# EAGLE design Leaf Node 1.0 (EAGLE 8.3.1)
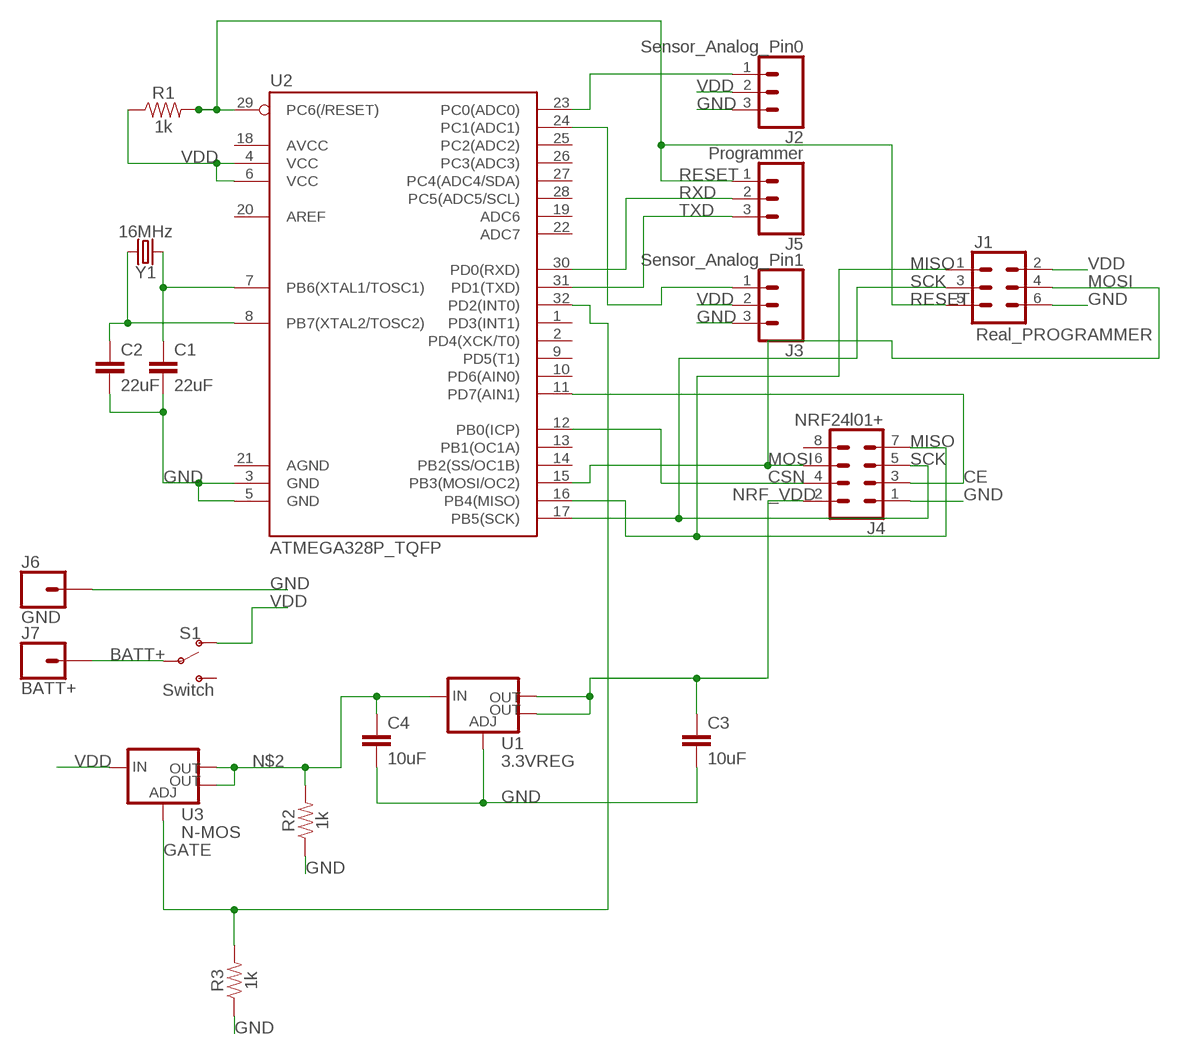
[diagram p0: schematic, sheet 1]

## Parts
C1  22uF  22UF-0805-6.3V-20%  [0805]
C2  22uF  22UF-0805-6.3V-20%  [0805]
C3  10uF  2.2UF-0805-25V-(+80/-20%)  [0805]
C4  10uF  2.2UF-0805-25V-(+80/-20%)  [0805]
J1  Real_PROGRAMMER  CONN_03X2FEMALE  [2X3]
J2  Sensor_Analog_Pin0  CONN_03  [1X03]
J3  Sensor_Analog_Pin1  CONN_03  [1X03]
J4  NRF24l01+  CONN_04X2  [2X4]
J5  Programmer  CONN_03  [1X03]
J6  GND  CONN_01  [1X01]
J7  BATT+  CONN_01  [1X01]
R1  1k  0.22OHM-0805-1/4W-1%  [0805]
R2  1k  0.22OHM-0805-1/4W-1%  [0805]
R3  1k  0.22OHM-0805-1/4W-1%  [0805]
S1  Switch  SWITCH-SPDT-PTH-11.6X4.0MM  [SWITCH_SPDT_PTH_11.6X4.0MM]
U1  3.3VREG  V_REG_LM1117SOT223  [SOT223]
U2  ATMEGA328P_TQFP  [TQFP32-08]
U3  N-MOS  V_REG_LM1117SOT223  [SOT223]
Y1  16MHz  CRYSTAL-16MHZPTH-HC49US  [HC49US]

## Nets
BATT+: J7.1 S1.2(P)
CE: J4.3 U2.11(PD7(AIN1))
CSN: J4.4 U2.12(PB0(ICP))
GATE: R3.2 U2.32(PD2(INT0)) U3.1(ADJ)
GND: C1.2 C2.2 C3.2 C4.2 J1.6 J2.3 J3.3 J4.1 J6.1 R2.1 R3.1 U1.1(ADJ) U2.3(GND) U2.5(GND)
MISO: J1.1 J4.7 U2.16(PB4(MISO))
MOSI: J1.4 J4.6 U2.15(PB3(MOSI/OC2))
N$1: C2.1 U2.8(PB7(XTAL2/TOSC2)) Y1.2
N$2: C4.1 R2.2 U1.3(IN) U3.2(OUT) U3.4(OUT)
N$3: C1.1 U2.7(PB6(XTAL1/TOSC1)) Y1.1
N$9: J3.1 U2.24(PC1(ADC1))
N$11: J2.1 U2.23(PC0(ADC0))
NRF_VDD: C3.1 J4.2 U1.2(OUT) U1.4(OUT)
RESET: J1.5 J5.1 R1.2 U2.29(PC6(/RESET))
RXD: J5.2 U2.30(PD0(RXD))
SCK: J1.3 J4.5 U2.17(PB5(SCK))
TXD: J5.3 U2.31(PD1(TXD))
VDD: J1.2 J2.2 J3.2 R1.1 S1.1(O) U2.4(VCC) U2.6(VCC) U3.3(IN)
Unconnected: J4.8 S1.3(S) U2.1(PD3(INT1)) U2.2(PD4(XCK/T0)) U2.9(PD5(T1)) U2.10(PD6(AIN0)) U2.13(PB1(OC1A)) U2.14(PB2(SS/OC1B)) U2.18(AVCC) U2.19(ADC6) U2.20(AREF) U2.21(AGND) U2.22(ADC7) U2.25(PC2(ADC2)) U2.26(PC3(ADC3)) U2.27(PC4(ADC4/SDA)) U2.28(PC5(ADC5/SCL))

## Library data of the parts
C1 C2 = SparkFun-Capacitors:22UF: 22µF ceramic capacitors A capacitor is a passive two-terminal electrical component used to store electrical energy temporarily in an electric field.; PROD_ID: CAP-08402
C3 C4 = SparkFun-Capacitors:2.2UF: 2.2µF ceramic capacitors A capacitor is a passive two-terminal electrical component used to store electrical energy temporarily in an electric field.; PROD_ID: CAP-11624; VALUE: 2.2uF
J1 = SparkFun-Connectors:CONN_03X2: Multi connection point. Often used as Generic Header-pin footprint for 0.1 inch spaced/style header connections You can populate with any combo of single row headers, but if you'd like an exact match, check these: Header - 2x3 (Male, 0.1") <https://www.sparkfun.com/products/12807> (PRT-12807) Header - 2x3 (Female, 0.1") <https://www.sparkfun.com/products/13010> (PRT-13010) 2x3 Pin Shrouded Header <https://www.sparkfun.com/products/10877> (PRT-10877) On any of the 0.1 inch spaced packages, you can populate with these: Break Away Headers - Straight <https://www.sparkfun.com/products/116> (PRT-00116) Break Away Male Headers - Right Angle <https://www.sparkfun.com/products/553> (PRT-00553) Female Headers <https://www.sparkfun.com/products/115> (PRT-00115) Break Away Headers - Machine Pin <https://www.sparkfun.com/products/117> (PRT-00117) Break Away Female Headers - Swiss Machine Pin <https://www.sparkfun.com/products/743> (PRT-00743) Special note: the shrouded connector mates well with our 3x2 ribbon cables: Ribbon Crimp Connector - 6-pin (2x3, Female) <https://www.sparkfun.com/products/10651> (PRT-10651) Ribbon Cable - 6 wire (15ft) <https://www.sparkfun.com/products/10646> (PRT-10646); PROD_ID: CONN-11566; VALUE: FEMALE 2x3
J2 J3 J5 = SparkFun-Connectors:CONN_03: Multi connection point. Often used as Generic Header-pin footprint for 0.1 inch spaced/style header connections On any of the 0.1 inch spaced packages, you can populate with these: Break Away Headers - Straight <https://www.sparkfun.com/products/116> (PRT-00116) Break Away Male Headers - Right Angle <https://www.sparkfun.com/products/553> (PRT-00553) Female Headers <https://www.sparkfun.com/products/115> (PRT-00115) Break Away Headers - Machine Pin <https://www.sparkfun.com/products/117> (PRT-00117) Break Away Female Headers - Swiss Machine Pin <https://www.sparkfun.com/products/743> (PRT-00743) Stackable Header - 3 Pin (Female, 0.1") <https://www.sparkfun.com/products/13875> (PRT-13875) For SCREWTERMINALS and SPRING TERMINALS visit here: Screw Terimnals on SparkFun.com <https://www.sparkfun.com/search/results?term=Screw+Terminals> (5mm/3.5mm/2.54mm spacing) This device is also useful as a general connection point to wire up your design to another part of your project. Our various solder wires solder well into these plated through hole pads. Hook-Up Wire - Assortment (Stranded, 22 AWG) <https://www.sparkfun.com/products/11375> (PRT-11375) Hook-Up Wire - Assortment (Solid Core, 22 AWG) <https://www.sparkfun.com/products/11367> (PRT-11367) View the entire wire category on our website here <https://www.sparkfun.com/categories/141> Special notes: Molex polarized connector foot print use with SKU : PRT-08232 with associated crimp pins and housings.
J4 = SparkFun-Connectors:CONN_04X2: Multi connection point. Often used as Generic Header-pin footprint for 0.1 inch spaced/style header connections On any of the 0.1 inch spaced packages, you can populate with these: Break Away Headers - Straight <https://www.sparkfun.com/products/116> (PRT-00116) Break Away Male Headers - Right Angle <https://www.sparkfun.com/products/553> (PRT-00553) Female Headers <https://www.sparkfun.com/products/115> (PRT-00115) Break Away Headers - Machine Pin <https://www.sparkfun.com/products/117> (PRT-00117) Break Away Female Headers - Swiss Machine Pin <https://www.sparkfun.com/products/743> (PRT-00743)
J6 J7 = SparkFun-Connectors:CONN_01: Single connection point. Often used as Generic Header-pin footprint for 0.1 inch spaced/style header connections On any of the 0.1 inch spaced packages, you can populate with these: Break Away Headers - Straight <https://www.sparkfun.com/products/116> (PRT-00116) Break Away Male Headers - Right Angle <https://www.sparkfun.com/products/553> (PRT-00553) Female Headers <https://www.sparkfun.com/products/115> (PRT-00115) Break Away Headers - Machine Pin <https://www.sparkfun.com/products/117> (PRT-00117) Break Away Female Headers - Swiss Machine Pin <https://www.sparkfun.com/products/743> (PRT-00743) This device is also useful as a general connection point to wire up your design to another part of your project. Our various solder wires solder well into these plated through hole pads. Hook-Up Wire - Assortment (Stranded, 22 AWG) <https://www.sparkfun.com/products/11375> (PRT-11375) Hook-Up Wire - Assortment (Solid Core, 22 AWG) <https://www.sparkfun.com/products/11367> (PRT-11367) View the entire wire category on our website here <https://www.sparkfun.com/categories/141> Special notes: SMTSO-256-ET is a "flush mount" nut for a 4-40 screw. We mostly use this on specialty testbeds; it is a nice way to connect hardware to your PCB at an adjustable hieght. Also note, the SNAP packages are for using a snappable style connector. We sell a baggie of snaps and they are also used on two LilyPad designs: Snap Assortment - 30 pack (male and female) <https://www.sparkfun.com/products/11347> (DEV-11347) LilyPad Arduino SimpleSnap <https://www.sparkfun.com/products/10941> (DEV-10941) LilyPad SimpleSnap Protoboard <https://www.sparkfun.com/products/10940> (DEV-10940)
R1-R3 = SparkFun-Resistors:0.22OHM: 0.22Ω resistor A resistor is a passive two-terminal electrical component that implements electrical resistance as a circuit element. Resistors act to reduce current flow, and, at the same time, act to lower voltage levels within circuits. - Wikipedia; PROD_ID: RES-09883; VALUE: 0.22
S1 = SparkFun-Switches:SWITCH-SPDT: Single Pole, Double Throw (SPDT) Switch Single-pole, double-throw (SPDT) switch. Variant Overview SMD-AYZ0202 Surface Mount DPDT Switch <https://www.sparkfun.com/products/597> (COM-00597) Used on e.g. LilyPad Arduino USB - ATmega32U4 Board <https://www.sparkfun.com/products/12049> PTH-11.6X4.0MM SPDT Mini Power Switch <https://www.sparkfun.com/products/102> (COM-00102) Used on e.g. SparkFun Simon Says - Through-Hole Soldering Kit <https://www.sparkfun.com/products/10547> (KIT-10547) PTH-11.6X4.0MM-KIT KIT version of SPDT Mini Power Switch - Simplifies soldering by removing tStop of switch pins - only one side can be soldered. PTH-11.6X4.0MM-LOCK LOCK version of SPDT Mini Power Switch - Offset pins hold switch in place for easier soldering. SMD-RIGHT-ANGLE Surface Mount Right Angle Switch <https://www.sparkfun.com/products/10860> (COM-10860) Used on e.g. SparkFun ESP8266 Thing <https://www.sparkfun.com/products/13231>; PROD_ID: SWCH-08261; SF_SKU: COM-00102
U1 U3 = SparkFun-IC-Power:V_REG_LM1117: Voltage Regulator LM1117 Standard adjustable voltage regulator but in SMD form. Spark Fun Electronics SKU : COM-00595; PROD_ID: VREG-08170
U2 = SparkFun-IC-Microcontroller:ATMEGA328P_TQFP: Popular 328P in QFP Storefront component: ATmega328 - TQFP <https://www.sparkfun.com/products/13448> (COM-13448) Datasheet <http://www.sparkfun.com/datasheets/Components/SMD/ATMega328.pdf> SparkFun Products SparkFun RedBoard - Programmed with Arduino <https://www.sparkfun.com/products/12757> (DEV-12757) Arduino Pro Mini 328 - 5V/16MHz <https://www.sparkfun.com/products/11113> (DEV-11113) Arduino Pro Mini 328 - 3.3V/8MHz <https://www.sparkfun.com/products/11114> (DEV-11114) SparkFun OpenLog <https://www.sparkfun.com/products/13712> (DEV-13712) SparkFun MicroView - OLED Arduino Module <https://www.sparkfun.com/products/12923> (DEV-12923) SparkFun Digital Sandbox <https://www.sparkfun.com/products/12651> (DEV-12651) SparkFun PicoBoard <https://www.sparkfun.com/products/11888> (WIG-11888) Arduino Fio <https://www.sparkfun.com/products/10116> (DEV-10116) LilyPad Arduino 328 Main Board <https://www.sparkfun.com/products/13342> (DEV-13342) SparkFun RedStick <https://www.sparkfun.com/products/13741> (DEV-13741) LilyPad MP3 <https://www.sparkfun.com/products/11013> (DEV-11013) LilyPad Arduino SimpleSnap <https://www.sparkfun.com/products/10941> (DEV-10941) SparkFun Stepoko <https://www.sparkfun.com/products/13899> (ROB-13899) SparkFun Geiger Counter <https://www.sparkfun.com/products/11345> (SEN-11345) SparkFun EL Sequencer <https://www.sparkfun.com/products/12781> (COM-12781) Arduino Pro 328 - 5V/16MHz <https://www.sparkfun.com/products/10915> (DEV-10915) CryptoCape <https://www.sparkfun.com/products/12773> (DEV-12773) SparkFun IR Thermometer Evaluation Board - MLX90614 <https://www.sparkfun.com/products/10740> (SEN-10740) SparkFun RedBot Mainboard <https://www.sparkfun.com/products/12097> (ROB-12097) Arduino Pro 328 - 3.3V/8MHz <https://www.sparkfun.com/products/10914> (DEV-10914) SparkFun Block for Intel® Edison - Arduino <https://www.sparkfun.com/products/13036> (DEV-13036) SparkFun Simon Says - Surface Mount Soldering Kit <https://www.sparkfun.com/products/10935> (KIT-10935) SparkFun 7-Segment Serial Display - Red <https://www.sparkfun.com/products/11441> (COM-11441) SparkFun 7-Segment Serial Display - White <https://www.sparkfun.com/products/11629> (COM-11629) SparkFun 7-Segment Serial Display - Yellow <https://www.sparkfun.com/products/11443> (COM-11443) SparkFun 7-Segment Serial Display - Kelly Green <https://www.sparkfun.com/products/11440> (COM-11440) SparkFun 7-Segment Serial Display - Blue <https://www.sparkfun.com/products/11442> (COM-11442) SparkFun OpenSegment Serial Display - 20mm (Blue) <https://www.sparkfun.com/products/11647> (COM-11647) SparkFun OpenSegment Serial Display - 20mm (Green) <https://www.sparkfun.com/products/11646> (COM-11646) SparkFun OpenSegment Serial Display - 20mm (White) <https://www.sparkfun.com/products/11648> (COM-11648) SparkFun OpenSegment Serial Display - 20mm (Red) <https://www.sparkfun.com/products/11644> (COM-11644) SparkFun OpenSegment Serial Display - 20mm (Yellow) <https://www.sparkfun.com/products/11645> (COM-11645) SparkFun OpenSegment Shield <https://www.sparkfun.com/products/13190> (DEV-13190); PROD_ID: IC-09069
Y1 = SparkFun-Clocks:CRYSTAL-16MHZ: 16MHz Crystal Digikey Example <http://www.digikey.com/product-search/en?keywords=535-9122-1-ND> Frequency: 16MHz Frequency Stability: ±50ppm Frequency Tolerance: ±20ppm Load Capacitance: 18pF SparkFun Products: Pro Micro -5V/16MHz <https://www.sparkfun.com/products/12640> SparkFun Serial Enabled LCD Kit <https://www.sparkfun.com/products/10097>; PROD_ID: XTAL-08181; SF_ID: COM-00536

## Board
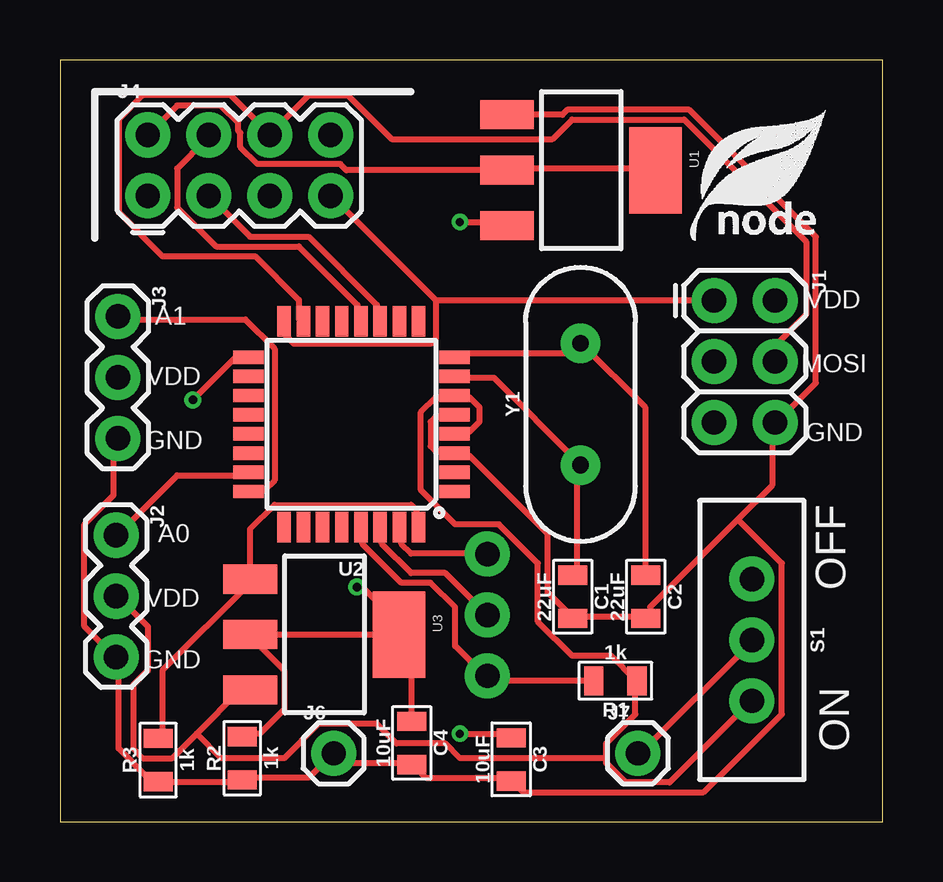
[diagram p1: board, top side]
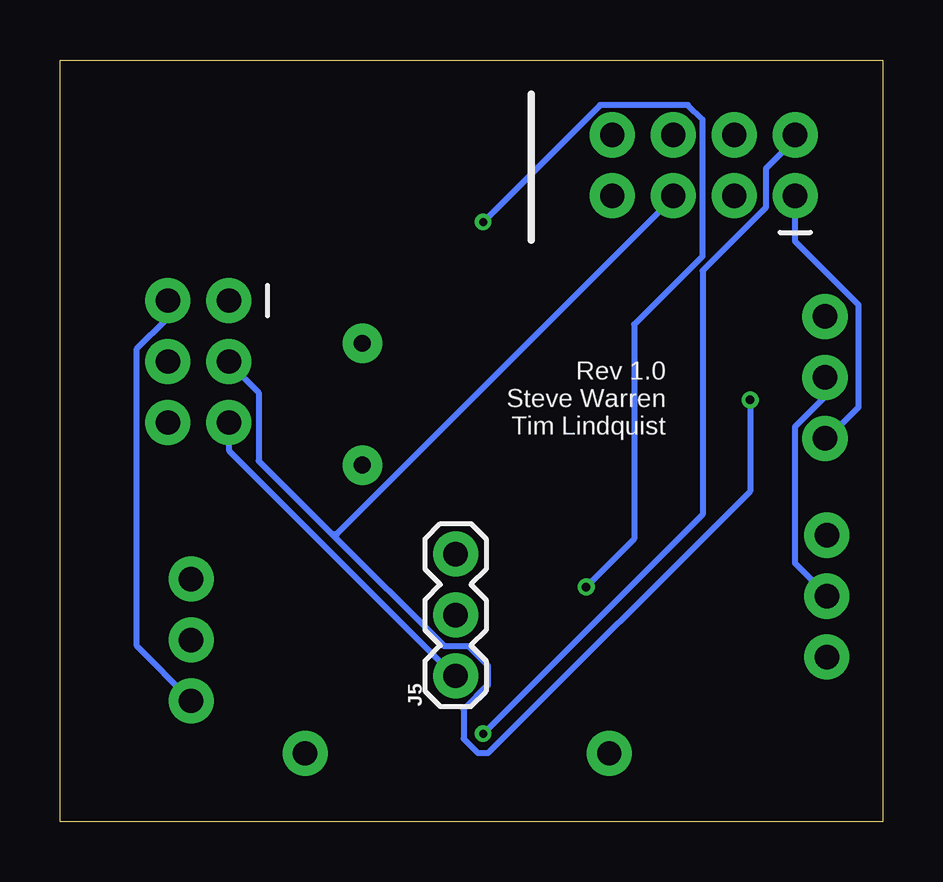
[diagram p2: board, bottom side, seen from below]

Size 34.29 x 31.75 mm. Coordinates in mm from the lower left corner, seen from the top.
Outline: 0,0 34.29,0 34.29,31.75 0,31.75 0,0
Copper layers (1*16): Top 0.0356mm / dielectric 1.5011mm / Bottom 0.0356mm
Design rules "LaenPCBOrder *": minimum track width 10mil, minimum drill 13mil, track to track 6mil, track to pad 6mil, pad to pad 6mil, via to via 6mil, smd to smd 6mil, copper to edge 15mil, drill to drill 6mil, minimum pad ring 7mil, minimum via ring 7mil, stop-mask expansion 3mil, vias tented up to drill 0mil, thermal gap 10mil

### Footprints (pad centres in the part's own frame; a part is rotated, then mirrored left to right if it is on the bottom)
0805 = smd 0.8 x 1.2: 1 -0.9,0; 2 0.9,0
2X3 = drill 1.016 pad 1.88: 1 0,0; 2 0,2.54; 3 2.54,0; 4 2.54,2.54; 5 5.08,0; 6 5.08,2.54
1X03 = drill 1.016 pad 1.88: 1 0,0; 2 2.54,0; 3 5.08,0
2X4 = drill 1.016 pad 1.88: 1 -3.81,-1.27; 2 -3.81,1.27; 3 -1.27,-1.27; 4 -1.27,1.27; 5 1.27,-1.27; 6 1.27,1.27; 7 3.81,-1.27; 8 3.81,1.27
1X01 = drill 1.016 pad 1.88: 1 0,0
SWITCH_SPDT_PTH_11.6X4.0MM = drill 1.016 pad 1.88: 1 0,2.54; 2 0,0; 3 0,-2.54
SOT223 = smd 1.219 x 2.235: 1 -2.311,-3.099; 2 0,-3.099; 3 2.311,-3.099 | smd 3.6 x 2.2: 4 0,3.099
TQFP32-08 = smd 1.27 x 0.559: 1 -4.293,2.8; 2 -4.293,2; 3 -4.293,1.2; 4 -4.293,0.4; 5 -4.293,-0.4; 6 -4.293,-1.2; 7 -4.293,-2; 8 -4.293,-2.8; 17 4.293,-2.8; 18 4.293,-2; 19 4.293,-1.2; 20 4.293,-0.4; 21 4.293,0.4; 22 4.293,1.2; 23 4.293,2; 24 4.293,2.8 | smd 0.559 x 1.27: 9 -2.8,-4.293; 10 -2,-4.293; 11 -1.2,-4.293; 12 -0.4,-4.293; 13 0.4,-4.293; 14 1.2,-4.293; 15 2,-4.293; 16 2.8,-4.293; 25 2.8,4.293; 26 2,4.293; 27 1.2,4.293; 28 0.4,4.293; 29 -0.4,4.293; 30 -1.2,4.293; 31 -2,4.293; 32 -2.8,4.293
HC49US = drill 0.7 pad 1.651: 1 -2.54,0; 2 2.54,0

### Placement (x,y rotation side)
C1  21.36,9.37 270 top
C2  24.41,9.37 270 top
C3  18.8,2.59 270 top
C4  14.66,3.28 270 top
J1  27.25,21.72 270 top
J2  2.34,11.94 270 top
J3  2.41,21.06 270 top
J4  7.47,27.36 0 top
J5  17.81,6.07 90 bottom
J6  11.4,2.84 0 top
J7  24.08,2.84 0 top
R1  23.14,5.87 180 top
R2  7.59,2.64 90 top
R3  4.09,2.57 90 top
S1  28.83,7.57 180 top
U1  21.72,27.15 270 top
U2  12.14,16.56 180 top
U3  11.02,7.8 270 top
Y1  21.69,17.4 90 top

### Tracks (layer width: path | path; a pad name or v marks a point on that pad's centre or on a via)
BATT+
  Top 0.254: J7.1 24.18,2.85 28.85,7.52 S1.2
CE
  Top 0.254: U2.11 13.21,20.93 13.21,21.54 10.36,24.38 7.92,24.38 6.3,26.01 J4.3
CSN
  Top 0.254: U2.12 12.39,20.93 12.39,21.54 9.96,23.98 6.5,23.98 4.88,25.6 4.88,27.23 6.1,28.45 J4.4
GATE
  Top 0.254: R3.2 4.27,3.66 4.27,6.3 7.92,9.96 U3.1 7.92,12.19 8.94,13.21 14.63,13.21 14.83,13.01 14.83,12.39 U2.32
GND
  Top 0.254: U2.5 16.26,16.87 15.65,16.87 15.44,16.66 15.44,15.65 15.65,15.44 16.26,15.44 U2.3 16.46,15.24 17.07,15.24 20.32,11.99 20.32,9.55 21.34,8.53 C1.2 21.54,8.53 24.38,8.53 C2.2 24.59,8.53 24.59,8.94 28.25,12.6 | U1.1 20.93,29.46 21.13,29.67 26.21,29.67 31.5,24.38 31.5,18.29 29.87,16.66 J1.6 29.67,16.46 29.67,14.02 28.25,12.6 | J3.3 2.23,15.85 2.23,13.61 1.02,12.39 1.02,8.13 2.23,6.91 J2.3 2.44,6.71 2.44,3.05 3.66,1.83 4.06,1.83 R3.1 4.27,1.63 7.52,1.63 R2.1 7.72,1.83 10.36,1.83 11.38,2.85 J6.1 11.58,2.85 11.99,2.44 14.63,2.44 C4.2 14.83,2.23 15.24,1.83 18.69,1.83 C3.2 18.9,1.63 19.3,1.22 26.82,1.22 30.07,4.47 30.07,10.77 28.25,12.6
  Bottom 0.254: J4.1 3.66,24.18 1.02,21.54 1.02,17.27 2.23,16.05 J3.3
MISO
  Top 0.254: 15.65,21.74 15.65,20.12 15.44,19.91 9.75,19.91 9.35,20.32 9.35,20.73 U2.16 | 15.65,21.74 11.38,26.01 J4.7 | 15.65,21.74 27.23,21.74 J1.1
MOSI
  Top 0.254: 8.74,28.65 7.11,30.28 3.45,30.28 2.44,29.26 2.44,25.4 4.27,23.57 8.13,23.57 9.96,21.74 9.96,20.93 U2.15 | 8.74,28.65 10.36,30.28 11.99,30.28 13.82,28.45 20.52,28.45 21.34,29.26 26.01,29.26 31.09,24.18 31.09,21.13 29.87,19.91 29.87,19.3 J1.4 | 8.74,28.65 J4.6
N$1
  Top 0.254: C2.1 24.38,10.36 24.38,17.27 21.74,19.91 Y1.2 21.54,19.91 21.13,19.51 16.46,19.51 U2.8
N$2  (via drill 0.33, 0.35)
  Top 0.254: 14.35,7.6 14.22,7.72 U3.4 U3.2 7.92,7.72 9.35,6.3 9.35,4.67 8.33,3.66 7.72,3.66 R2.2 | 14.35,7.6 14.63,7.32 14.63,4.27 C4.1 | v16.66,24.99 18.49,24.99 U1.3 | v12.37,9.78 12.6,9.78 14.02,8.36 13.99,8.36 13.49,8.87 13.77,8.87 13.79,8.84 13.79,8.15 14.35,7.6
  Bottom 0.254: v16.66,24.99 11.79,29.87 8.13,29.87 7.52,29.26 7.52,23.57 10.36,20.73 10.36,11.79 v12.37,9.78
N$3
  Top 0.254: C1.1 21.54,10.36 21.54,14.83 Y1.1 21.54,15.04 18.09,18.49 16.46,18.49 U2.7
N$9
  Top 0.254: U2.24 7.92,13.82 8.53,13.82 8.94,14.22 8.94,19.71 7.72,20.93 2.44,20.93 J3.1
N$11
  Top 0.254: U2.23 7.72,14.43 4.88,14.43 2.44,11.99 J2.1
NRF_VDD  (via drill 0.33)
  Top 0.254: U1.4 24.79,27.23 18.69,27.23 U1.2 11.94,27.15 11.68,27.41 8.23,27.41 7.52,28.12 7.52,28.7 7.42,28.8 7.42,29.13 6.7,29.84 4.88,29.84 J4.2 | v16.66,3.66 18.69,3.66 C3.1
  Bottom 0.254: v16.66,3.66 7.52,12.8 7.52,22.96 4.88,25.6 4.88,27.23 3.66,28.45 J4.2
RESET
  Top 0.254: R1.2 22.15,5.89 17.88,5.89 J5.1 17.68,6.1 16.46,7.32 16.46,8.94 15.44,9.96 14.22,9.96 12.6,11.58 12.6,12.19 U2.29
  Bottom 0.254: J1.5 27.23,16.46 27.23,15.44 17.88,6.1 J5.1
RXD
  Top 0.254: J5.2 16.05,10.36 14.63,10.36 13.41,11.58 13.41,12.19 U2.30
SCK  (via drill 0.35)
  Top 0.254: U2.17 7.32,19.36 v5.54,17.58
  Bottom 0.254: 22.96,11.99 26.01,15.04 26.01,17.88 27.23,19.1 J1.3 | 22.96,11.99 18.29,7.32 17.27,7.32 16.46,6.5 16.46,5.69 17.48,4.67 17.48,3.45 16.87,2.85 16.46,2.85 5.54,13.77 v5.54,17.58 | 22.96,11.99 22.76,11.99 8.74,26.01 J4.5
TXD
  Top 0.254: U2.31 14.22,12.19 14.22,11.58 14.63,11.18 17.68,11.18 J5.3
VDD
  Top 0.254: U3.3 7.52,5.49 5.69,3.66 | 5.69,3.66 4.67,2.64 3.45,2.64 3.05,3.05 3.05,5.69 3.66,6.3 3.66,8.13 2.44,9.35 J2.2 | U2.4 16.46,16.26 17.07,16.26 17.48,16.66 17.48,17.27 17.07,17.68 16.46,17.68 U2.6 16.26,17.68 15.65,17.68 15.04,17.07 15.04,13.82 16.46,12.39 18.29,12.39 19.91,10.77 19.91,8.33 21.34,6.91 22.96,6.91 23.98,5.89 R1.1 23.98,5.69 23.98,4.47 22.76,3.25 22.76,2.64 | 22.76,2.64 22.76,2.44 23.57,1.63 25.4,1.63 28.65,4.88 S1.1 | 5.69,3.66 6.71,2.64 9.35,2.64 10.77,4.06 13.21,4.06 14.02,3.25 16.05,3.25 16.66,2.64 22.76,2.64
  Bottom 0.254: J3.2 2.44,18.49 2.44,17.68 3.66,16.46 3.66,10.77 2.44,9.55 J2.2 | J1.2 29.87,21.54 29.87,20.93 31.09,19.71 31.09,7.32 28.85,5.08 S1.1

### Text on the board
tPlace: VDD | A1 | VDD | MOSI | GND | GND | A0 | VDD | OFF | GND | ON
bPlace: Rev 1.0 / Steve Warren / Tim Lindquist